# Altium schematic sheet Pg2-Filter and Gain.SchDoc: MSP430F6779 + Crystal
size 431 x 279 mm; Date: Not shown in title block; ApprovedBy: Not shown in title block; CheckedBy: Not shown in title block; Author: Not shown in title block; CompanyName: Not shown in title block; Engineer: Not shown in title block; Organization: Not shown in title block; Address1: Not shown in title block; Address2: Not shown in title block; Address3: Not shown in title block; Address4: Not shown in title block; DocumentNumber: 6; Revision: Use project parameter SCH_Rev; SheetNumber: 3; SheetTotal: 9; PageSetup: Record=PageOptions|CenterHorizontal=True|CenterVertical=True|PrintScale=1.00|XCorrection=1.00|YCorrection=1.00|PrintKind=0|BorderSize=5000000|LeftOffset=0|BottomOffset=0|Orientation=2|PaperLength=1000|PaperWidth=1000|Scale=100|PaperSource=15|PrintQuality=600|MediaType=1|DitherType=10|PaperKind=Letter|PrintScaleMode=1; CurrentTime: Not shown in title block; CurrentDate: Not shown in title block; Time: Not shown in title block; DocumentFullPathAndName: Not shown in title block; DocumentName: Not shown in title block; ModifiedDate: Not shown in title block; ImagePath: Not shown in title block
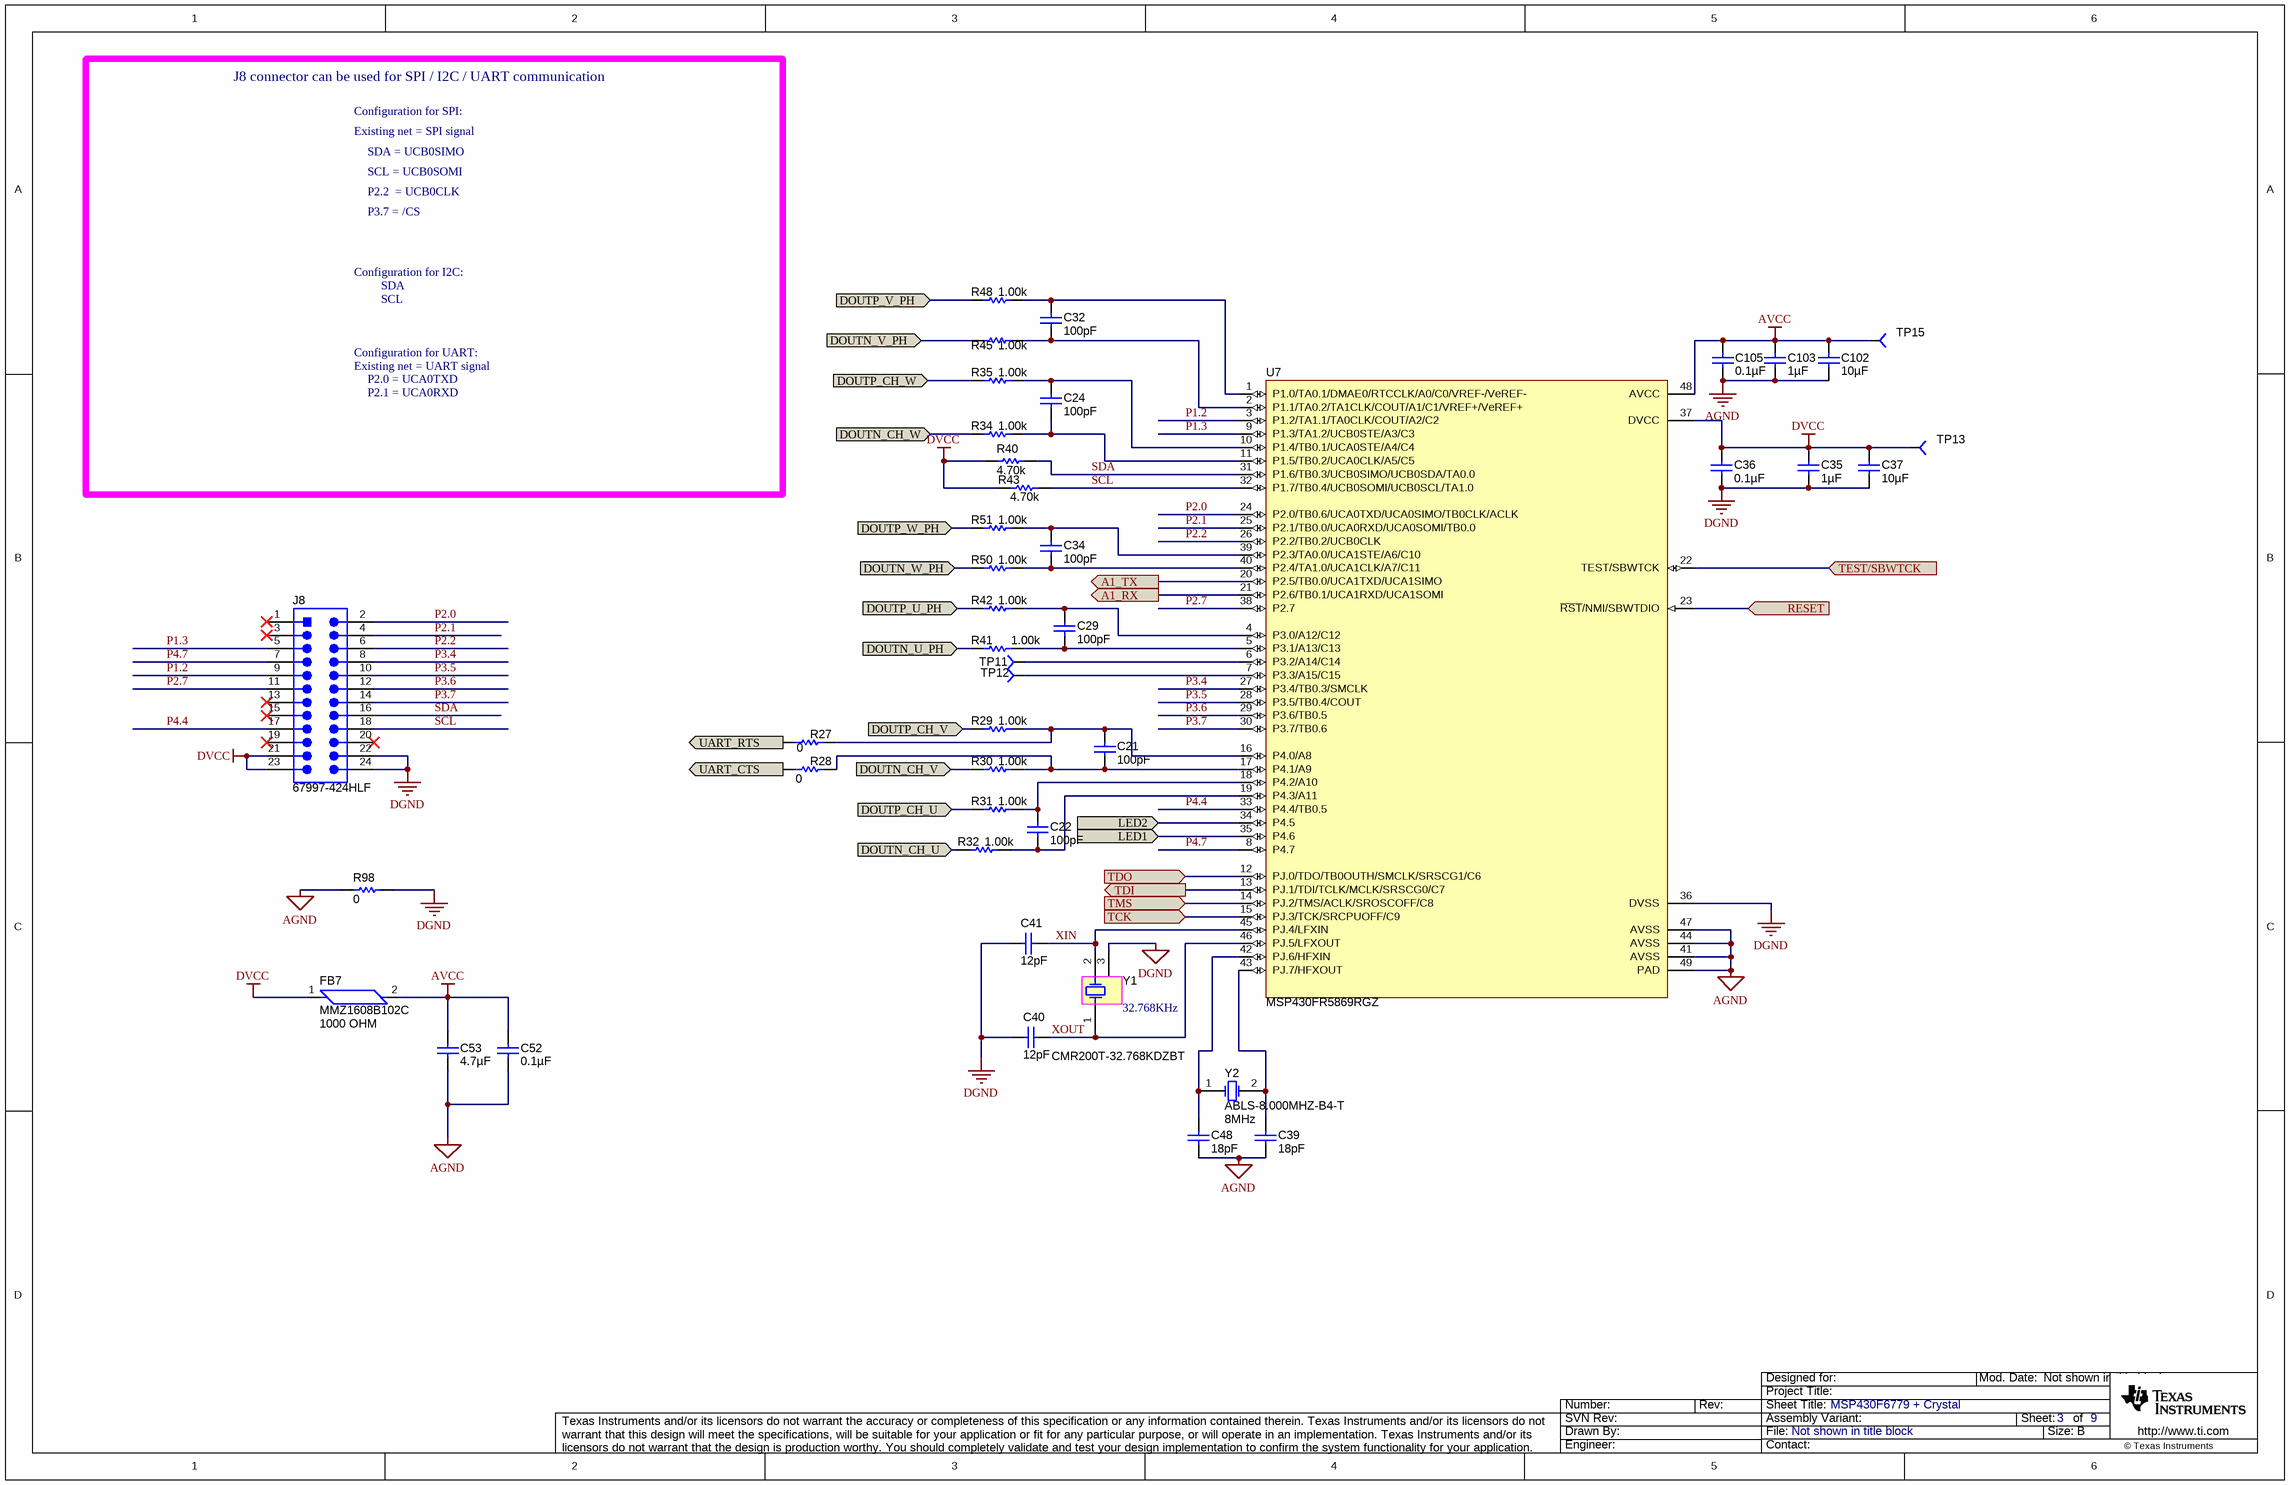
[diagram p0: Pg2-Filter and Gain.SchDoc]

## Parts
C21  ValueDisplayed: 100pF  [0603]  (hidden comment: C0603C101J5GAC)
C22  ValueDisplayed: 100pF  [0603]  (hidden comment: C0603C101J5GAC)
C24  ValueDisplayed: 100pF  [0603]  (hidden comment: C0603C101J5GAC)
C29  ValueDisplayed: 100pF  [0603]  (hidden comment: C0603C101J5GAC)
C32  ValueDisplayed: 100pF  [0603]  (hidden comment: C0603C101J5GAC)
C34  ValueDisplayed: 100pF  [0603]  (hidden comment: C0603C101J5GAC)
C35  ValueDisplayed: 1µF  [0603]  (hidden comment: GRM188R71C105KA12D)
C36  ValueDisplayed: 0.1µF  [0603]  (hidden comment: 0603YC104JAT2A)
C37  ValueDisplayed: 10µF  [0603]  (hidden comment: GRM188R61E106MA73)
C39  ValueDisplayed: 18pF  [0603]  (hidden comment: GRM1885C1H180JA01D)
C40  ValueDisplayed: 12pF  [0603]  (hidden comment: 06035A120JAT2A)
C41  ValueDisplayed: 12pF  [0603]  (hidden comment: 06035A120JAT2A)
C48  ValueDisplayed: 18pF  [0603]  (hidden comment: GRM1885C1H180JA01D)
C52  ValueDisplayed: 0.1µF  [0603]  (hidden comment: 06033C104JAT2A)
C53  ValueDisplayed: 4.7µF  [0603]  (hidden comment: 0603ZD475KAT2A)
C102  ValueDisplayed: 10µF  [0603]  (hidden comment: GRM188R61E106MA73)
C103  ValueDisplayed: 1µF  [0603]  (hidden comment: GRM188R71C105KA12D)
C105  ValueDisplayed: 0.1µF  [0603]  (hidden comment: 0603YC104JAT2A)
FB7  MMZ1608B102C  value 1000 OHM  [FB0603]
J8  67997-424HLF  [TSW-112-07-G-D]
R27  value 0  [0603]  (hidden comment: CRCW06030000Z0EA)
R28  value 0  [0603]  (hidden comment: CRCW06030000Z0EA)
R29  ValueDisplayed: 1.00k  [0603]  (hidden comment: RG1608P-102-B-T5)
R30  ValueDisplayed: 1.00k  [0603]  (hidden comment: RG1608P-102-B-T5)
R31  ValueDisplayed: 1.00k  [0603]  (hidden comment: RG1608P-102-B-T5)
R32  ValueDisplayed: 1.00k  [0603]  (hidden comment: RG1608P-102-B-T5)
R34  ValueDisplayed: 1.00k  [0603]  (hidden comment: RG1608P-102-B-T5)
R35  ValueDisplayed: 1.00k  [0603]  (hidden comment: RG1608P-102-B-T5)
R40  value 4.70k  [0603]  (hidden comment: RC0603FR-074K7L)
R41  ValueDisplayed: 1.00k  [0603]  (hidden comment: RG1608P-102-B-T5)
R42  ValueDisplayed: 1.00k  [0603]  (hidden comment: RG1608P-102-B-T5)
R43  value 4.70k  [0603]  (hidden comment: RC0603FR-074K7L)
R45  ValueDisplayed: 1.00k  [0603]  (hidden comment: RG1608P-102-B-T5)
R48  ValueDisplayed: 1.00k  [0603]  (hidden comment: RG1608P-102-B-T5)
R50  ValueDisplayed: 1.00k  [0603]  (hidden comment: RG1608P-102-B-T5)
R51  ValueDisplayed: 1.00k  [0603]  (hidden comment: RG1608P-102-B-T5)
R98  value 0  [0805_HV]  (hidden comment: CRCW08050000Z0EA)
TP11  TP-040_RND  [TP-040_RND]  (value not drawn)
TP12  TP-040_RND  [TP-040_RND]  (value not drawn)
TP13  TP-040_RND  [TP-040_RND]  (value not drawn)
TP15  TP-040_RND  [TP-040_RND]  (value not drawn)
U7  MSP430FR5869RGZ  [RGZ0048B]
Y1  CMR200T-32.768KDZBT  Frequency: 32.768KHz  [XTAL_CMR200T]
Y2  ABLS-8.000MHZ-B4-T  Frequency: 8MHz  [XTAL_CSM-7X]

## Ports
A1_RX (out), A1_TX (out), DOUTN_CH_U (in), DOUTN_CH_V (in), DOUTN_CH_W (in), DOUTN_U_PH (in), DOUTN_V_PH (in), DOUTN_W_PH (in), DOUTP_CH_U (in), DOUTP_CH_V (in), DOUTP_CH_W (in), DOUTP_U_PH (in), DOUTP_V_PH (in), DOUTP_W_PH (in), LED1 (in), LED2 (in), RESET, TCK, TDI (out), TDO, TEST/SBWTCK, TMS, UART_CTS, UART_RTS

## Nets
AGND: C39.2 C48.2 C52.2 C53.2 C102.2 C103.2 C105.2 R98.1 U7.41(AVSS) U7.44(AVSS) U7.47(AVSS) U7.49(PAD)
AVCC: C52.1 C53.1 C102.1 C103.1 C105.1 FB7.2 TP15.1 U7.48(AVCC)
DGND: C35.2 C36.2 C37.2 C40.2 C41.2 J8.22 J8.24 R98.2 U7.36(DVSS) Y1.3
DVCC: C35.1 C36.1 C37.1 FB7.1 J8.21 J8.23 R40.1 R43.1 TP13.1 U7.37(DVCC)
A1_RX: U7.21(P2.6/TB0.1/UCA1RXD/UCA1SOMI) ; port A1_RX
A1_TX: U7.20(P2.5/TB0.0/UCA1TXD/UCA1SIMO) ; port A1_TX
DOUTN_CH_U: R32.1 ; port DOUTN_CH_U
DOUTN_CH_V: R30.1 ; port DOUTN_CH_V
DOUTN_CH_W: R34.1 ; port DOUTN_CH_W
DOUTN_U_PH: R41.1 ; port DOUTN_U_PH
DOUTN_V_PH: R45.1 ; port DOUTN_V_PH
DOUTN_W_PH: R50.1 ; port DOUTN_W_PH
DOUTP_CH_U: R31.1 ; port DOUTP_CH_U
DOUTP_CH_V: R29.1 ; port DOUTP_CH_V
DOUTP_CH_W: R35.1 ; port DOUTP_CH_W
DOUTP_U_PH: R42.1 ; port DOUTP_U_PH
DOUTP_V_PH: R48.1 ; port DOUTP_V_PH
DOUTP_W_PH: R51.1 ; port DOUTP_W_PH
LED1: U7.35(P4.6) ; port LED1
LED2: U7.34(P4.5) ; port LED2
P1.2: J8.9 U7.3(P1.2/TA1.1/TA0CLK/COUT/A2/C2)
P1.3: J8.5 U7.9(P1.3/TA1.2/UCB0STE/A3/C3)
P2.0: J8.2 U7.24(P2.0/TB0.6/UCA0TXD/UCA0SIMO/TB0CLK/ACLK)
P2.1: J8.4 U7.25(P2.1/TB0.0/UCA0RXD/UCA0SOMI/TB0.0)
P2.2: J8.6 U7.26(P2.2/TB0.2/UCB0CLK)
P2.7: J8.11 U7.38(P2.7)
P3.4: J8.8 U7.27(P3.4/TB0.3/SMCLK)
P3.5: J8.10 U7.28(P3.5/TB0.4/COUT)
P3.6: J8.12 U7.29(P3.6/TB0.5)
P3.7: J8.14 U7.30(P3.7/TB0.6)
P4.4: J8.17 U7.33(P4.4/TB0.5)
P4.7: J8.7 U7.8(P4.7)
RESET: U7.23(~{RST}/NMI/SBWTDIO) ; port RESET
SCL: J8.18 R43.2 U7.32(P1.7/TB0.4/UCB0SOMI/UCB0SCL/TA1.0)
SDA: J8.16 R40.2 U7.31(P1.6/TB0.3/UCB0SIMO/UCB0SDA/TA0.0)
TCK: U7.15(PJ.3/TCK/SRCPUOFF/C9) ; port TCK
TDI: U7.13(PJ.1/TDI/TCLK/MCLK/SRSCG0/C7) ; port TDI
TDO: U7.12(PJ.0/TDO/TB0OUTH/SMCLK/SRSCG1/C6) ; port TDO
TEST/SBWTCK: U7.22(TEST/SBWTCK) ; port TEST/SBWTCK
TMS: U7.14(PJ.2/TMS/ACLK/SROSCOFF/C8) ; port TMS
UART_CTS: R28.1 ; port UART_CTS
UART_RTS: R27.1 ; port UART_RTS
XIN: C41.1 U7.45(PJ.4/LFXIN) Y1.2
XOUT: C40.1 U7.46(PJ.5/LFXOUT) Y1.1
NetC21_1: C21.1 R28.2 R30.2 U7.17(P4.1/A9)
NetC21_2: C21.2 R27.2 R29.2 U7.16(P4.0/A8)
NetC22_1: C22.1 R32.2 U7.19(P4.3/A11)
NetC22_2: C22.2 R31.2 U7.18(P4.2/A10)
NetC24_1: C24.1 R34.2 U7.11(P1.5/TB0.2/UCA0CLK/A5/C5)
NetC24_2: C24.2 R35.2 U7.10(P1.4/TB0.1/UCA0STE/A4/C4)
NetC29_1: C29.1 R41.2 U7.5(P3.1/A13/C13)
NetC29_2: C29.2 R42.2 U7.4(P3.0/A12/C12)
NetC32_1: C32.1 R45.2 U7.2(P1.1/TA0.2/TA1CLK/COUT/A1/C1/VREF+/VeREF+)
NetC32_2: C32.2 R48.2 U7.1(P1.0/TA0.1/DMAE0/RTCCLK/A0/C0/VREF-/VeREF-)
NetC34_1: C34.1 R50.2 U7.40(P2.4/TA1.0/UCA1CLK/A7/C11)
NetC34_2: C34.2 R51.2 U7.39(P2.3/TA0.0/UCA1STE/A6/C10)
NetC39_1: C39.1 U7.43(PJ.7/HFXOUT) Y2.2(OSC2)
NetC48_1: C48.1 U7.42(PJ.6/HFXIN) Y2.1(OSC1)
NetTP11_1: TP11.1 U7.6(P3.2/A14/C14)
NetTP12_1: TP12.1 U7.7(P3.3/A15/C15)

Not connected (* = marked no-connect by the designer): J8 1* 3* 13* 15* 19* 20*

## Notes on the sheet
- J8 connector can be used for SPI / I2C / UART communication
- Configuration for SPI:
- Existing net = SPI signal
- SDA = UCB0SIMO
- SCL = UCB0SOMI
- P2.2  = UCB0CLK
- P3.7 = /CS
- Configuration for I2C:
- SDA
- SCL
- Configuration for UART:
- Existing net = UART signal
- P2.0 = UCA0TXD
- P2.1 = UCA0RXD
- Drawn By:
- SVN Rev:
- Number:
- Rev:
- Sheet Title:
- File:
- Project Title:
- Designed for:
- Assembly Variant:
- Mod. Date:
- Sheet:
- Size:
- of
- B
- http://www.ti.com
- Texas Instruments and/or its licensors do not warrant the accuracy or completeness of this specification or any information contained therein. Texas Instruments and/or its licensors do not warrant that this design will meet the specifications, will be suitable for your application or fit for any particular purpose, or will operate in an implementation. Texas Instruments and/or its licensors do not warrant that the design is production worthy. You should completely validate and test your design implementation to confirm the system functionality for your application.
- Engineer:
- Contact:
- © Texas Instruments

## Library data of the parts
C21 C22 C24 C29 C32 C34 = C0603C101J5GAC: CAP, CERM, 100 pF, 50 V, +/- 5%, C0G/NP0, 0603; Manufacturer: Kemet; Polarized: N; CompType: Capacitor; Value: 100pF; U/M: EA; Cap_F: 0.0000000001; Tolerance_%: 5; Value1: Unknown; VDC_V: 50; Value2: 50V; TaMin_C: -55; TaMax_C: 125; SymbolVersion: 2008-07-09; PartNumber: C0603C101J5GAC; PackageReference: 0603; RoHS: Y; MountType: SMT; Technology: Ceramic; TempCo: C0G/NP0; Cap_Case: 0603; Published: 2008-06-19; Publisher: Texas Instruments; LatestRevisionDate: 2015-02-10; ComponentLink1Description: Datasheet link; ComponentLink1URL: http://www.kemet.com/kemet/web/homepage/kechome.nsf/vapubfiles/F3102_Y5V.pdf/$file/F3102_Y5V.pdf; Supplier 1: Farnell; Supplier Part Number 1: 1414602
C35 C103 = GRM188R71C105KA12D: CAP, CERM, 1 µF, 16 V, +/- 10%, X7R, 0603; Manufacturer: MuRata; Polarized: N; CompType: Capacitor; Value: 1uF; U/M: EA; Cap_F: 0.000001; Tolerance_%: 10; ESR_ohm: 0.011; Value1: 0.011 ohm; VDC_V: 16; Value2: 16V; TaMin_C: -55; TaMax_C: 125; SymbolVersion: 2008-07-09; PartNumber: GRM188R71C105KA12D; PackageReference: 0603; RoHS: Y; MountType: SMT; Technology: Ceramic; TempCo: X7R; Cap_Case: 0603; Published: 2008-06-19; Publisher: Texas Instruments; LatestRevisionDate: 2015-02-10; ComponentLink1Description: Datasheet link; ComponentLink1URL: http://search.murata.co.jp/Ceramy/PnsearchViewAction.do?HnOFG=ON&HnNFG=ON&SEL_CNT=50&sLang=en&sKey=GRM188R71C105KA12D&x=9&y=9&search=startwith; Supplier 1: Digi-Key; Supplier Part Number 1: 490-3900-1-ND; Supplier 2: Mouser; Supplier Part Number 2: 81-GRM188R71C105KA12; Supplier 3: Farnell; Supplier Part Number 3: 1828826
C36 C105 = 0603YC104JAT2A: CAP, CERM, 0.1 µF, 16 V, +/- 5%, X7R, 0603; Manufacturer: AVX; Polarized: N; CompType: Capacitor; Value: 0.1uF; U/M: EA; Cap_F: 0.0000001; Tolerance_%: 5; ESR_ohm: 0.039; Value1: 0.039 ohm; VDC_V: 16; Value2: 16V; TaMin_C: -55; TaMax_C: 125; SymbolVersion: 2008-07-09; PartNumber: 0603YC104JAT2A; PackageReference: 0603; RoHS: Y; MountType: SMT; Technology: Ceramic; TempCo: X7R; Cap_Case: 0603; Published: 2008-06-19; Publisher: Texas Instruments; LatestRevisionDate: 2015-02-10; ComponentLink1Description: Datasheet link; ComponentLink1URL: http://www.avx.com/docs/masterpubs/smccp.pdf; Supplier 1: Digi-Key; Supplier Part Number 1: 478-3726-1-ND; Supplier 2: Mouser; Supplier Part Number 2: 581-0603YC104J; Supplier 3: Farnell; Supplier Part Number 3: 1740612
C37 C102 = GRM188R61E106MA73: CAP, CERM, 10uF, 25V, +/-20%, X5R, 0603; Manufacturer: MuRata; Polarized: N; CompType: Capacitor; U/M: EA; Cap_F: 0.00001; Tolerance_%: 20; Value1: Unknown; VDC_V: 25; TaMin_C: -55; TaMax_C: 85; SymbolVersion: 2008-07-09; Value: 10uF; PartNumber: GRM188R61E106MA73; PackageReference: 0603; RoHS: Y; Value2: 25V; MountType: SMT; Technology: Ceramic; TempCo: X5R; Cap_Case: 0603; Published: 2008-06-19; Publisher: Texas Instruments; LatestRevisionDate: 2014-05-15; ComponentLink1Description: Datasheet link; ComponentLink1URL: http://psearch.murata.com/capacitor/product/GRM188R61E106MA73%23.pdf; Supplier 1: Digi-Key; Supplier Part Number 1: 490-7202-1-ND; Supplier 2: Mouser; Supplier Part Number 2: 81-GRM188R61E106MA3L; Supplier 3: Farnell; Supplier Part Number 3: 1828803RL
C39 C48 = GRM1885C1H180JA01D: CAP, CERM, 18pF, 50V, +/-5%, C0G/NP0, 0603; Manufacturer: MuRata; Polarized: N; CompType: Capacitor; U/M: EA; Cap_F: 0.000000000018; Tolerance_%: 5; Value1: Unknown; VDC_V: 50; TaMin_C: -55; TaMax_C: 125; SymbolVersion: 2008-07-09; Value: 18pF; PartNumber: GRM1885C1H180JA01D; PackageReference: 0603; RoHS: Y; Value2: 50V; MountType: SMT; Technology: Ceramic; TempCo: C0G/NP0; Cap_Case: 0603; Published: 2008-06-19; Publisher: Texas Instruments; LatestRevisionDate: 2014-05-15; ComponentLink1Description: Datasheet link; ComponentLink1URL: http://search.murata.co.jp/Ceramy/PnsearchViewAction.do?HnOFG=ON&HnNFG=ON&SEL_CNT=50&sLang=en&sKey=GRM1885C1H180JA01D&x=9&y=9&search=startwith; Supplier 1: Digi-Key; Supplier Part Number 1: 490-1409-1-ND; Supplier 2: Mouser; Supplier Part Number 2: 81-GRM39C180J50; Supplier 3: Farnell; Supplier Part Number 3: 1828908
C40 C41 = 06035A120JAT2A: CAP, CERM, 12pF, 50V, +/-5%, C0G/NP0, 0603; Manufacturer: AVX; Polarized: N; CompType: Capacitor; U/M: EA; Cap_F: 0.000000000012; Tolerance_%: 5; ESR_Ohm: 0.363; Value1: 0.363 ohm; VDC_V: 50; TaMin_C: -55; TaMax_C: 125; SymbolVersion: 2008-07-09; Value: 12pF; PartNumber: 06035A120JAT2A; PackageReference: 0603; RoHS: Y; Value2: 50V; MountType: SMT; Technology: Ceramic; TempCo: C0G/NP0; Cap_Case: 0603; Published: 2008-06-19; Publisher: Texas Instruments; LatestRevisionDate: 2014-05-15; ComponentLink1Description: Datasheet link; ComponentLink1URL: http://www.avx.com/docs/masterpubs/smccp.pdf; Supplier 1: Digi-Key; Supplier Part Number 1: 478-1164-1-ND; Supplier 2: Mouser; Supplier Part Number 2: 581-06035A120J; Supplier 3: Farnell; Supplier Part Number 3: 1462447
C52 = 06033C104JAT2A: CAP, CERM, 0.1uF, 25V, +/-5%, X7R, 0603; Manufacturer: AVX; Polarized: N; CompType: Capacitor; U/M: EA; Cap_F: 0.0000001; Tolerance_%: 5; ESR_Ohm: 0.05; Value1: 0.05 ohm; VDC_V: 25; TaMin_C: -55; TaMax_C: 125; SymbolVersion: 2008-07-09; Value: 0.1uF; PartNumber: 06033C104JAT2A; PackageReference: 0603; RoHS: Y; Value2: 25V; MountType: SMT; Technology: Ceramic; TempCo: X7R; Cap_Case: 0603; Published: 2008-06-19; Publisher: Texas Instruments; LatestRevisionDate: 2014-05-15; ComponentLink1Description: Datasheet link; ComponentLink1URL: http://www.avx.com/docs/masterpubs/smccp.pdf; Supplier 1: Digi-Key; Supplier Part Number 1: 478-3713-1-ND; Supplier 2: Mouser; Supplier Part Number 2: 581-06033C104JAT2A; Supplier 3: Farnell; Supplier Part Number 3: 1740614
C53 = 0603ZD475KAT2A: CAP, CERM, 4.7uF, 10V, +/-10%, X5R, 0603; Manufacturer: AVX; Polarized: N; CompType: Capacitor; U/M: EA; Cap_F: 0.0000047; Tolerance_%: 10; Value1: Unknown; TaMin_C: -55; TaMax_C: 85; SymbolVersion: 2008-07-09; Value: 4.7uF; PartNumber: 0603ZD475KAT2A; PackageReference: 0603; RoHS: Y; VDC_V: 10; Value2: 10V; MountType: SMT; Technology: Ceramic; TempCo: X5R; Cap_Case: 0603; Published: 2008-06-19; Publisher: Texas Instruments; LatestRevisionDate: 2014-05-15; ComponentLink1Description: Datasheet link; ComponentLink1URL: http://www.avx.com/docs/Catalogs/cx5r.pdf; Supplier 1: Digi-Key; Supplier Part Number 1: 478-7943-1-ND; Supplier 2: Mouser; Supplier Part Number 2: 581-0603ZD475KAT2A; Supplier 3: Farnell; Supplier Part Number 3: 1833806
FB7 = MMZ1608B102C: FERRITE CHIP 1000 OHM 300MA 0603; Manufacturer: TDK Corporation; CompType: Ferrite Bead; PartNumber: MMZ1608B102C; MountType: SMT; Alternate PartNumber: *; Supplier 1: Digi-Key; ComponentLink1URL: http://www.tdk.co.jp/tefe02/e9412_mmz.pdf; ComponentLink1Description: Datasheet link; Publisher: TI; Supplier Part Number 1: 445-8672-1-ND; PackageReference: 0603; Alternate Manufacturer: *; RoHS: Y
J8 = TSW-112-07-G-D: Header, TH, 100mil, 12x2, Gold plated, 230 mil above insulator; Manufacturer: FCI; SymbolCreator: a0412235; U/M: EA; SymbolVersion: 2013-09-11; PartNumber: 67997-424HLF; ClassName: Header; PackageReference: 12x2 Header; CompType: Header; RoHS: Y; MountType: TH; ComponentLink1Description: Datasheet Link; ComponentLink1URL: http://samtec.com/ftppub/pdf/TSW_TH.PDF; Publisher: Texas Instruments; LatestRevisionDate: 2014-05-15; Supplier 1: Digi-Key; Supplier Part Number 1: 609-3245-ND
R27 R28 = CRCW06030000Z0EA: RES, 0 ohm, 5%, 0.1W, 0603; Manufacturer: Vishay-Dale; CompType: Resistor; Value_Code: 0000; Tolerance_%: 5; Power_W: 0.1; VDC_V: 75; TempCo: 200 ppm/C; EIA_Code: E24; U/M: EA; SymbolVersion: 2009-05-29; PartNumber: CRCW06030000Z0EA; PackageReference: 0603; RoHS: Y; Res_ohm: 0; Value1: 5%; Value2: 0.1W; MountType: SMT; Technology: Thick Film; Published: 2008-06-26; Publisher: Texas Instruments; LatestRevisionDate: 2014-05-20; ComponentLink1Description: Datasheet link; ComponentLink1URL: http://www.vishay.com/docs/20035/dcrcwe3.pdf; Supplier 1: Digi-Key; Supplier Part Number 1: 541-0.0GCT-ND; Supplier 2: Mouser; Supplier Part Number 2: 71-CRCW0603-0-E3; Supplier 3: Farnell; Supplier Part Number 3: 1469739
R29-R32 R34 R35 R41 R42 R45 R48 R50 R51 = RG1608P-102-B-T5: RES, 1.00 k, 0.1%, 0.1 W, 0603; Manufacturer: Susumu Co Ltd; CompType: Resistor; Value: 1.00k; Res_ohm: 1000; Value_Code: 1k00; Tolerance_%: 0.1; Value2: 0.1W; VDC_V: 75; TempCo: 25 ppm/C; EIA_Code: E192; U/M: EA; SymbolVersion: 2009-05-29; PartNumber: RG1608P-102-B-T5; PackageReference: 0603; RoHS: Y; Value1: 0.1%; Power_W: 0.1; MountType: SMT; Technology: Metal Film; Published: 2008-06-26; Publisher: Texas Instruments; LatestRevisionDate: 2014-12-16; ComponentLink1Description: Datasheet link; ComponentLink1URL: http://www.susumu.co.jp/english/pdf/products-j01-01.pdf; Supplier 1: Digi-Key; Supplier Part Number 1: RG16P1.0KBCT-ND; Supplier 2: Mouser; Supplier Part Number 2: 754-RG1608P-102-B-T5; Supplier 3: Farnell; Supplier Part Number 3: 1797076
R40 R43 = RC0603FR-074K7L: RES, 4.70k ohm, 1%, 0.1W, 0603; Manufacturer: Yageo America; CompType: Resistor; Res_ohm: 4700; Value_Code: 4k70; Tolerance_%: 1; Power_W: 0.1; VDC_V: 150; TempCo: 200 ppm/C; U/M: EA; SymbolVersion: 2009-05-29; PartNumber: RC0603FR-074K7L; PackageReference: 0603; RoHS: Y; Value1: 1%; Value2: 0.1W; MountType: SMT; Technology: Thick Film; Published: 2008-06-26; Publisher: Texas Instruments; LatestRevisionDate: 2014-05-20; ComponentLink1Description: Datasheet link; ComponentLink1URL: http://www.yageo.com/pdf/Pu-RC0603_51_PbFree_L_2.pdf; Supplier 1: Digi-Key; Supplier Part Number 1: 311-4.70KHRCT-ND; Supplier 2: Mouser; Supplier Part Number 2: 603-RC0603FR-074K7L; Supplier 3: Farnell; Supplier Part Number 3: 9238565
R98 = CRCW0805330KJNEA: RES, 0 ohm, 5%, 0.125W, 0805; Manufacturer: Vishay-Dale; CompType: Resistor; Tolerance_%: 5; Power_W: 0.125; VDC_V: 150; TempCo: 200 ppm/C; EIA_Code: E24; U/M: EA; SymbolVersion: 2009-05-29; PartNumber: CRCW08050000Z0EA; PackageReference: 0805; RoHS: Y; Res_ohm: 0; Value_Code: 0; Value1: 5%; Value2: 0.125W; MountType: SMT; Technology: Thick Film; Published: 2008-06-26; Publisher: Texas Instruments; LatestRevisionDate: 2014-04-18; ComponentLink1Description: Datasheet link; ComponentLink1URL: http://www.vishay.com/docs/20035/dcrcwe3.pdf; Supplier 1: Digi-Key; Supplier Part Number 1: 541-0.0ACT-ND
TP11-TP13 TP15 = TP-040_RND: Test Point, O.040 Hole; Manufacturer: STD; Value: STD; area: *; SymbolVersion: 06/30/2008 16:03:57; PartNumber: STD; ComponentLink1Description: AEO Datasheet Link
U7 = MSP430FR5969IRGZ: Mixed Signal Microcontroller, RGZ0048B; Manufacturer: Texas Instruments; SymbolCreator: a0411947; CompType: IC; U/M: EA; SymbolVersion: 2014-05-06; PartNumber: MSP430FR5869RGZ; PackageReference: RGZ0048B; MountType: SMT; ComponentLink1Description: Datasheet Link; ComponentLink1URL: http://www.ti.com/lit/ds/symlink/msp430fr5969.pdf; RoHS: Y; Publisher: Texas Instruments; LatestRevisionDate: 2015-02-10; Alternate Manufacturer: Texas Instruments
Y1 = CMR200T-32.768KDZBT: CRYSTAL, 32.768KHz, 6PF, +/- 20PPM, SMD-3P; Manufacturer: CITIZEN; SymbolCreator: x0199378; SymbolVersion: 2014-05-19; PartNumber: CMR200T-32.768KDZBT; CompType: Crystal; PackageReference: -; MountType: SMT; RoHS: Y; ComponentLink1Description: Datasheet Link; ComponentLink1URL: http://cfm.citizen.co.jp/english/product/pdf/CMR200T.pdf; Alternate Manufacturer: -; Alternate PartNumber: -; Supplier 1: Digi-Key; Supplier Part Number 1: 300-8341-1-ND
Y2 = ABLS-8.000MHZ-B4-T: Crystal, 8MHz, 18pF, SMD; Manufacturer: Abracon Corportation; SymbolCreator: a0412235; U/M: EA; TaMin_C: 0; TaMax_C: 70; Frequency Stability: ±50ppm; SymbolVersion: 2008-07-09; PartNumber: ABLS-8.000MHZ-B4-T; CompType: Crystal; PackageReference: Crystal, 11.4x4.3x3.8mm; MountType: SMT; RoHS: Y; ComponentLink1Description: Datasheet Link; ComponentLink1URL: http://www.abracon.com/Resonators/abls.pdf; Publisher: Texas Instruments; LatestRevisionDate: 2014-07-28; Supplier 1: Digi-Key; Supplier Part Number 1: 535-10212-1-ND; Supplier 2: Mouser; Supplier Part Number 2: 815-ABLS-8.0M-T